# EAGLE design LED_MATRIX (EAGLE 7.2.0)
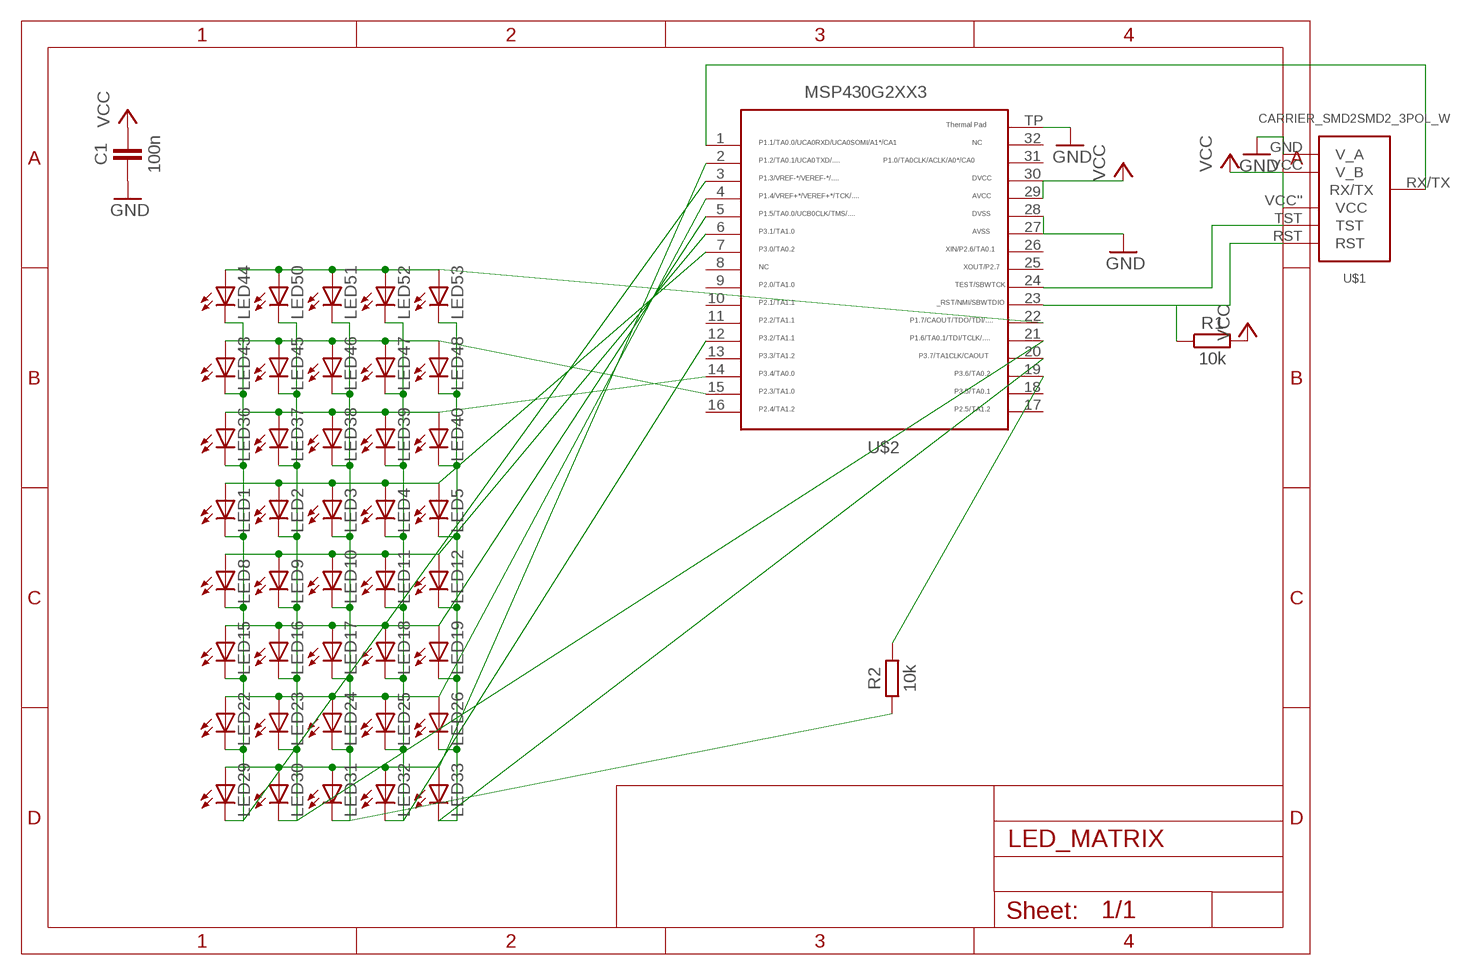
[diagram p0: schematic, sheet 1]

## Parts
C1  100n  CAPACITOR  [603]
LED1  LEDCHIPLED_0603  [CHIPLED_0603]
LED2  LEDCHIPLED_0603  [CHIPLED_0603]
LED3  LEDCHIPLED_0603  [CHIPLED_0603]
LED4  LEDCHIPLED_0603  [CHIPLED_0603]
LED5  LEDCHIPLED_0603  [CHIPLED_0603]
LED8  LEDCHIPLED_0603  [CHIPLED_0603]
LED9  LEDCHIPLED_0603  [CHIPLED_0603]
LED10  LEDCHIPLED_0603  [CHIPLED_0603]
LED11  LEDCHIPLED_0603  [CHIPLED_0603]
LED12  LEDCHIPLED_0603  [CHIPLED_0603]
LED15  LEDCHIPLED_0603  [CHIPLED_0603]
LED16  LEDCHIPLED_0603  [CHIPLED_0603]
LED17  LEDCHIPLED_0603  [CHIPLED_0603]
LED18  LEDCHIPLED_0603  [CHIPLED_0603]
LED19  LEDCHIPLED_0603  [CHIPLED_0603]
LED22  LEDCHIPLED_0603  [CHIPLED_0603]
LED23  LEDCHIPLED_0603  [CHIPLED_0603]
LED24  LEDCHIPLED_0603  [CHIPLED_0603]
LED25  LEDCHIPLED_0603  [CHIPLED_0603]
LED26  LEDCHIPLED_0603  [CHIPLED_0603]
LED29  LEDCHIPLED_0603  [CHIPLED_0603]
LED30  LEDCHIPLED_0603  [CHIPLED_0603]
LED31  LEDCHIPLED_0603  [CHIPLED_0603]
LED32  LEDCHIPLED_0603  [CHIPLED_0603]
LED33  LEDCHIPLED_0603  [CHIPLED_0603]
LED36  LEDCHIPLED_0603  [CHIPLED_0603]
LED37  LEDCHIPLED_0603  [CHIPLED_0603]
LED38  LEDCHIPLED_0603  [CHIPLED_0603]
LED39  LEDCHIPLED_0603  [CHIPLED_0603]
LED40  LEDCHIPLED_0603  [CHIPLED_0603]
LED43  LEDCHIPLED_0603  [CHIPLED_0603]
LED44  LEDCHIPLED_0603  [CHIPLED_0603]
LED45  LEDCHIPLED_0603  [CHIPLED_0603]
LED46  LEDCHIPLED_0603  [CHIPLED_0603]
LED47  LEDCHIPLED_0603  [CHIPLED_0603]
LED48  LEDCHIPLED_0603  [CHIPLED_0603]
LED50  LEDCHIPLED_0603  [CHIPLED_0603]
LED51  LEDCHIPLED_0603  [CHIPLED_0603]
LED52  LEDCHIPLED_0603  [CHIPLED_0603]
LED53  LEDCHIPLED_0603  [CHIPLED_0603]
R1  10k  RESISTOR0603  [603]
R2  10k  RESISTOR0603S  [603_SMALL]
U$1  CARRIER_SMD2SMD2_3POL_W  [CARRIER_SMD2_WIDE_3POL]
U$2  MSP430G2553  [QFN32]

## Nets
GND: C1.1 U$1.GND(V_A) U$2.27 U$2.28 U$2.TP
N$2: U$1.TST U$2.24
N$4: R1.1 U$1.RST U$2.23
N$12: U$1.RX/TX U$2.1
N$20: LED36.A LED37.A LED38.A LED39.A LED40.A U$2.14
N$21: LED44.A LED50.A LED51.A LED52.A LED53.A U$2.22
N$23: LED43.A LED45.A LED46.A LED47.A LED48.A U$2.15
N$25: R2.2 U$2.19
N$38: LED1.A LED2.A LED3.A LED4.A LED5.A U$2.7
N$39: LED8.A LED9.A LED10.A LED11.A LED12.A U$2.6
N$40: LED15.A LED16.A LED17.A LED18.A LED19.A U$2.5
N$41: LED22.A LED23.A LED24.A LED25.A LED26.A U$2.4
N$42: LED29.A LED30.A LED31.A LED32.A LED33.A U$2.2
N$43: LED1.C LED8.C LED15.C LED22.C LED29.C LED36.C LED43.C LED44.C U$2.3
N$44: LED2.C LED9.C LED16.C LED23.C LED30.C LED37.C LED45.C LED50.C U$2.21
N$45: LED3.C LED10.C LED17.C LED24.C LED31.C LED38.C LED46.C LED51.C R2.1
N$46: LED4.C LED11.C LED18.C LED25.C LED32.C LED39.C LED47.C LED52.C U$2.12
N$47: LED5.C LED12.C LED19.C LED26.C LED33.C LED40.C LED48.C LED53.C U$2.20
VCC: C1.2 R1.2 U$1.VCC''(VCC) U$1.VCC(V_B) U$2.29 U$2.30
Unconnected: U$2.8 U$2.9 U$2.10 U$2.11 U$2.13 U$2.16 U$2.17 U$2.18 U$2.25 U$2.26 U$2.31 U$2.32

## Library data of the parts
C1 = thar:CAPACITOR
LED1-LED5 LED8-LED12 LED15-LED19 LED22-LED26 LED29-LED33 LED36-LED40 LED43-LED48 LED50-LED53 = led:LED: LED OSRAM: - CHIPLED LG R971, LG N971, LY N971, LG Q971, LY Q971, LO R971, LY R971 LH N974, LH R974 LS Q976, LO Q976, LY Q976 LO Q996 - Hyper CHIPLED LW Q18S LB Q993, LB Q99A, LB R99A - SideLED LS A670, LO A670, LY A670, LG A670, LP A670 LB A673, LV A673, LT A673, LW A673 LH A674 LY A675 LS A676, LA A676, LO A676, LY A676, LW A676 LS A679, LY A679, LG A679 - Hyper Micro SIDELED® LS Y876, LA Y876, LO Y876, LY Y876 LT Y87S - SmartLED LW L88C, LW L88S LB L89C, LB L89S, LG L890 LS L89K, LO L89K, LY L89K LS L896, LA L896, LO L896, LY L896 - TOPLED LS T670, LO T670, LY T670, LG T670, LP T670 LSG T670, LSP T670, LSY T670, LOP T670, LYG T670 LG T671, LOG T671, LSG T671 LB T673, LV T673, LT T673, LW T673 LH T674 LS T676, LA T676, LO T676, LY T676, LB T676, LH T676, LSB T676, LW T676 LB T67C, LV T67C, LT T67C, LS T67K, LO T67K, LY T67K, LW E67C LS E67B, LA E67B, LO E67B, LY E67B, LB E67C, LV E67C, LT E67C LW T67C LS T679, LY T679, LG T679 LS T770, LO T770, LY T770, LG T770, LP T770 LB T773, LV T773, LT T773, LW T773 LH T774 LS E675, LA E675, LY E675, LS T675 LS T776, LA T776, LO T776, LY T776, LB T776 LHGB T686 LT T68C, LB T68C - Hyper Mini TOPLED® LB M676 - Mini TOPLED Santana® LG M470 LS M47K, LO M47K, LY M47K Source: http://www.osram.convergy.de LUXEON: - LUMILED® LXK2-PW12-R00, LXK2-PW12-S00, LXK2-PW14-U00, LXK2-PW14-V00 LXK2-PM12-R00, LXK2-PM12-S00, LXK2-PM14-U00 LXK2-PE12-Q00, LXK2-PE12-R00, LXK2-PE12-S00, LXK2-PE14-T00, LXK2-PE14-U00 LXK2-PB12-K00, LXK2-PB12-L00, LXK2-PB12-M00, LXK2-PB14-N00, LXK2-PB14-P00, LXK2-PB14-Q00 LXK2-PR12-L00, LXK2-PR12-M00, LXK2-PR14-Q00, LXK2-PR14-R00 LXK2-PD12-Q00, LXK2-PD12-R00, LXK2-PD12-S00 LXK2-PH12-R00, LXK2-PH12-S00 LXK2-PL12-P00, LXK2-PL12-Q00, LXK2-PL12-R00 Source: www.luxeon.com KINGBRIGHT: KA-3528ASYC Source: www.kingbright.com
R1 R2 = thar:RESISTOR
U$1 = thar:CARRIER_SMD2
U$2 = thar:MSP430G2553: TEXAS INSTRUMENTS MSP430G2553IRHB32R MCU, 16BIT, MSP430, 16MHZ, QFN-32 Farnell Best.Nr.: 2325726 Herst.Bez.: MSP430G2553IRHB32R

## Board
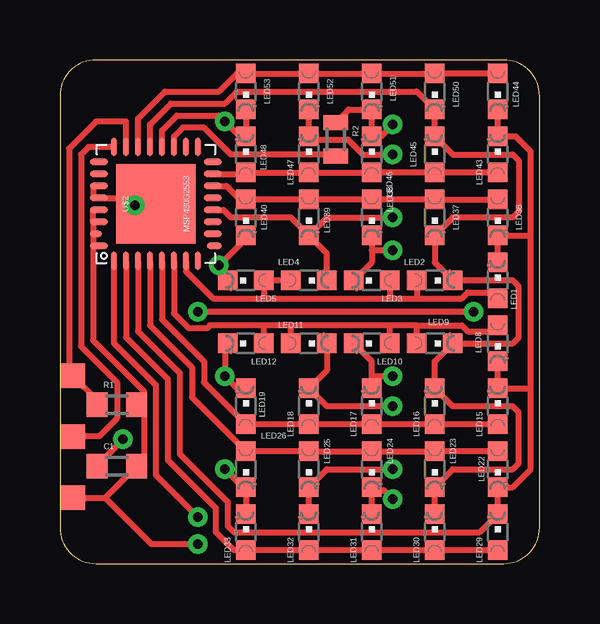
[diagram p1: board, top side]
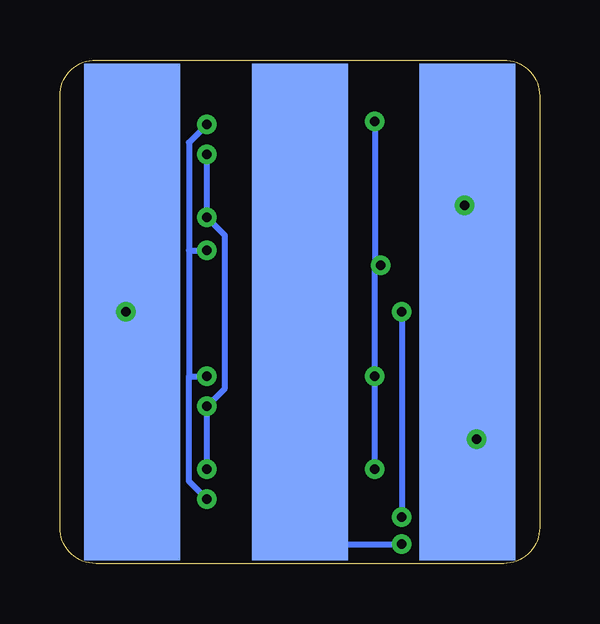
[diagram p2: board, bottom side, seen from below]

Size 20 x 21 mm. Coordinates in mm from the lower left corner, seen from the top.
Copper layers (1*16): Top 0.035mm / dielectric 1.5mm / Bottom 0.035mm
Design rules "Bilex DRU *": minimum track width 10mil, minimum drill 24mil, track to track 10mil, track to pad 10mil, pad to pad 10mil, via to via 10mil, smd to smd 10mil, copper to edge 1mil, drill to drill 8mil, minimum pad ring 10mil, minimum via ring 8mil, stop-mask expansion 4mil, vias tented up to drill 0mil, thermal gap 10mil

### Footprints (pad centres in the part's own frame; a part is rotated, then mirrored left to right if it is on the bottom)
603 = smd 0.889 x 1.016: 1 -0.826,0; 2 0.826,0
CHIPLED_0603 = smd 0.8 x 0.8: A 0,-0.75; C 0,0.75
603_SMALL = smd 0.635 x 1.016: 1 -0.699,0; 2 0.699,0
CARRIER_SMD2_WIDE_3POL = smd 4 x 20.7 bottom: GND -6.985,3.493; RX/TX 6.985,3.493; VCC 0,3.493 | smd 1.016 x 1.016: RST -9.461,0.826; TST -9.461,-1.714; VCC'' -9.461,-4.255
QFN32 = smd 0.762 x 0.254: 1 -2.375,1.75; 2 -2.375,1.25; 3 -2.375,0.75; 4 -2.375,0.25; 5 -2.375,-0.25; 6 -2.375,-0.75; 7 -2.375,-1.25; 8 -2.375,-1.75; 17 2.375,-1.75; 18 2.375,-1.25; 19 2.375,-0.75; 20 2.375,-0.25; 21 2.375,0.25; 22 2.375,0.75; 23 2.375,1.25; 24 2.375,1.75 | smd 0.254 x 0.635: 9 -1.75,-2.438 | smd 0.254 x 0.762: 10 -1.25,-2.375; 11 -0.75,-2.375; 12 -0.25,-2.375; 13 0.25,-2.375; 14 0.75,-2.375; 15 1.25,-2.375; 16 1.75,-2.375; 25 1.75,2.375; 26 1.25,2.375; 27 0.75,2.375; 28 0.25,2.375; 29 -0.25,2.375; 30 -0.75,2.375; 32 -1.75,2.375 | smd 0.254 x 0.508: 31 -1.25,2.5 | smd 3.302 x 3.302: TP 0,0

### Placement (x,y rotation side)
C1  2.38,4.06 0 top
LED1  18.25,11.81 0 top
LED2  15.62,11.81 270 top
LED3  13,11.81 90 top
LED4  10.38,11.81 270 top
LED5  7.75,11.81 90 top
LED8  18.25,9.19 180 top
LED9  15.62,9.19 270 top
LED10  13,9.19 90 top
LED11  10.38,9.19 270 top
LED12  7.75,9.19 90 top
LED15  18.25,6.56 0 top
LED16  15.62,6.56 0 top
LED17  13,6.56 0 top
LED18  10.38,6.56 0 top
LED19  7.75,6.56 0 top
LED22  18.25,3.94 180 top
LED23  15.62,3.94 180 top
LED24  13,3.94 180 top
LED25  10.38,3.94 180 top
LED26  7.75,3.94 180 top
LED29  18.25,1.31 0 top
LED30  15.62,1.31 0 top
LED31  13,1.31 0 top
LED32  10.38,1.31 0 top
LED33  7.75,1.31 0 top
LED36  18.25,14.44 180 top
LED37  15.62,14.44 180 top
LED38  13,14.44 180 top
LED39  10.38,14.44 180 top
LED40  7.75,14.44 180 top
LED43  18.25,17.06 0 top
LED44  18.25,19.69 180 top
LED45  15.62,17.06 0 top
LED46  13,17.06 0 top
LED47  10.38,17.06 0 top
LED48  7.75,17.06 0 top
LED50  15.62,19.69 180 top
LED51  13,19.69 180 top
LED52  10.38,19.69 180 top
LED53  7.75,19.69 180 top
R1  2.38,6.62 0 top
R2  11.5,17.69 270 top
U$1  10,7 0 top
U$2  4,15 90 top

### Tracks (layer width: path | path; a pad name or v marks a point on that pad's centre or on a via)
GND  (via drill 0.4)
  Top 0.254: v3.12,14.94 3.19,15 U$2.TP 3.75,15.25 U$2.28 1.38,15.25 1.38,15.75 U$2.27 | C1.1 1.62,4.19 v2.62,5.19
  Bottom 0.254: v3.12,14.94 3.12,11.81 | 3.12,11.81 3.12,10.6 U$1.GND | v2.62,5.19 2.62,11.31 3.12,11.81
N$2
  Top 0.254: U$2.24 1.19,17.37 0.88,17.06 0.88,9.06 2.38,7.56 2.38,6.06 1.62,5.31 0.57,5.31 U$1.TST
N$4
  Top 0.254: U$2.23 2.75,18.44 1.5,18.44 0.38,17.31 0.38,7.99 U$1.RST 1.55,6.81 R1.1
N$12  (via drill 0.4)
  Top 0.254: v17.25,10.5 v5.75,10.5 | v5.75,1.94 4,3.69 4,7.44 2.25,9.19 U$2.1
  Bottom 0.254: U$1.RX/TX 15.63,10.55 v17.25,10.5 | v5.75,10.5 v5.75,1.94
N$20
  Top 0.254: LED36.A LED37.A LED38.A LED39.A LED40.A 7.5,15.19 6.94,15.75 U$2.14
N$21
  Top 0.254: LED44.A LED50.A LED51.A LED52.A LED53.A 7.38,20.44 6.62,19.69 4.38,19.69 3.25,18.56 U$2.22
N$23
  Top 0.254: LED43.A LED45.A LED46.A LED47.A LED48.A 7.69,16.25 U$2.15
N$25
  Top 0.254: R2.2 11.5,17.06 7.12,17.06 6,18.19 5.12,18.19 4.75,17.81 U$2.19
N$38
  Top 0.254: LED4.A LED5.A 8.5,11.06 | U$2.7 5.25,12.19 6.38,11.06 8.5,11.06 | 8.5,11.06 13.75,11.06 | 13.75,11.06 14.88,11.06 | LED2.A 14.88,11.06 | LED3.A 13.75,11.06 | 14.88,11.06 16.75,11.06 17,11.31 18,11.31 LED1.A
N$39
  Top 0.254: U$2.6 4.75,10.44 5.38,9.81 6.12,9.81 6.25,9.94 8.5,9.94 | 18.38,9.81 LED8.A 18,9.69 17,9.69 16.75,9.94 14.88,9.94 | 14.88,9.94 13.75,9.94 | 13.75,9.94 9.62,9.94 | 9.62,9.94 8.5,9.94 | LED12.A 8.5,9.94 | LED11.A 9.62,9.94 | LED9.A 14.88,9.94 | LED10.A 13.75,9.94
N$40
  Top 0.254: LED15.A LED16.A LED17.A LED18.A LED19.A 6,7.56 6,8.44 4.25,10.19 U$2.5
N$41
  Top 0.254: LED22.A LED23.A LED24.A LED25.A LED26.A 5.5,6.94 5.5,8.19 3.75,9.94 U$2.4
N$42
  Top 0.254: LED29.A LED30.A LED31.A LED32.A LED33.A 7.25,0.56 6.5,1.31 6.5,2.31 4.5,4.31 4.5,7.69 2.75,9.44 U$2.2
N$43
  Top 0.254: LED8.C LED15.C 19.62,7.31 | 19.62,7.31 19.62,3.94 18.88,3.19 LED22.C LED29.C 17.5,1.31 7.25,1.31 7,1.56 7,2.56 5,4.56 5,7.94 3.25,9.69 U$2.3 | 19.62,7.31 19.62,13.69 | 19.62,13.69 19.62,17.19 19,17.81 LED43.C LED44.C | LED1.C LED36.C 19.62,13.69
N$44
  Top 0.254: LED30.C LED23.C 16.38,3.94 18.88,3.94 19.12,4.19 19.12,6.31 18.88,6.56 16.38,6.56 LED16.C 15.62,8.44 LED9.C 18.88,9.19 19.12,9.44 19.12,11.56 18.88,11.81 LED2.C 15.62,12.56 LED37.C 16.38,14.44 18.88,14.44 19.12,14.69 19.12,16.81 18.88,17.06 16.38,17.06 LED45.C LED50.C 14.88,19.69 7.38,19.69 6.88,19.19 4.62,19.19 3.75,18.31 U$2.21
N$45  (via drill 0.4)
  Top 0.254: LED31.C 13,3.06 | 13,3.06 LED24.C | v13.88,18.31 13.38,17.81 LED46.C LED51.C 12.05,18.94 R2.1 | 13,3.06 13.5,3.06 v13.88,2.69 | LED3.C 13,12.56 13,13.06 | LED38.C 13,13.06 | LED17.C 13,7.81 | 13,7.81 13,8.44 LED10.C | v13.88,13.06 13,13.06 | v13.88,7.81 13,7.81
  Bottom 0.254: v13.88,2.69 14.62,3.44 14.62,7.81 | 14.62,13.06 14.62,7.81 | 14.62,7.81 v13.88,7.81 | v13.88,18.31 14.62,17.56 14.62,13.06 | 14.62,13.06 v13.88,13.06
N$46  (via drill 0.4)
  Top 0.254: LED32.C LED25.C 11.12,3.94 v13.88,3.94 | LED52.C LED47.C 10.38,17.69 12,17.69 12.62,17.06 v13.88,17.06 | v13.88,6.56 11.12,6.56 LED18.C 11.12,8.06 LED11.C | LED39.C 11.12,14.44 v13.88,14.44 | LED39.C 9.62,14.44 7.12,14.44 6.81,14.75 U$2.12 | LED4.C 11.12,12.94 LED39.C
  Bottom 0.254: v13.88,3.94 v13.88,6.56 13.12,7.31 13.12,13.69 v13.88,14.44 v13.88,17.06
N$47  (via drill 0.4)
  Top 0.254: LED33.C LED26.C 7.62,3.19 v6.88,3.94 | LED53.C LED48.C 7.5,17.81 v6.88,18.44 6.62,18.69 4.88,18.69 4.25,18.06 U$2.20 | LED12.C 6.88,9.19 v6.88,7.81 7.38,7.31 LED19.C | LED5.C 6.88,11.94 6.88,12.19 v6.62,12.44 7.75,13.56 LED40.C
  Bottom 0.254: v6.88,18.44 6.88,12.44 | 6.88,12.44 v6.88,7.81 v6.88,3.94 | 6.88,12.44 v6.62,12.44
VCC  (via drill 0.4)
  Top 0.254: 0.38,2.91 U$1.VCC'' 1.88,2.75 | 1.88,2.75 C1.2 3.5,4.36 3.5,6.69 3.44,6.62 R1.2 3.5,6.92 3.5,7.19 1.38,9.31 1.38,14.25 | v5.75,0.81 3.82,0.81 1.88,2.75 | U$2.29 1.38,14.75 1.38,14.25 | U$2.30 1.38,14.25
  Bottom 0.254: U$1.VCC 10,18.69 8.88,19.81 8.75,0.81 v5.75,0.81